# Altium schematic sheet TemperatureSense.SchDoc: fNIRS - Temperature Sense
size A4; CompanyName: UofT Capstone Team 2024991; DrawnBy: Tony Kim; Revision: 1; SheetNumber: 11; SheetTotal: 13
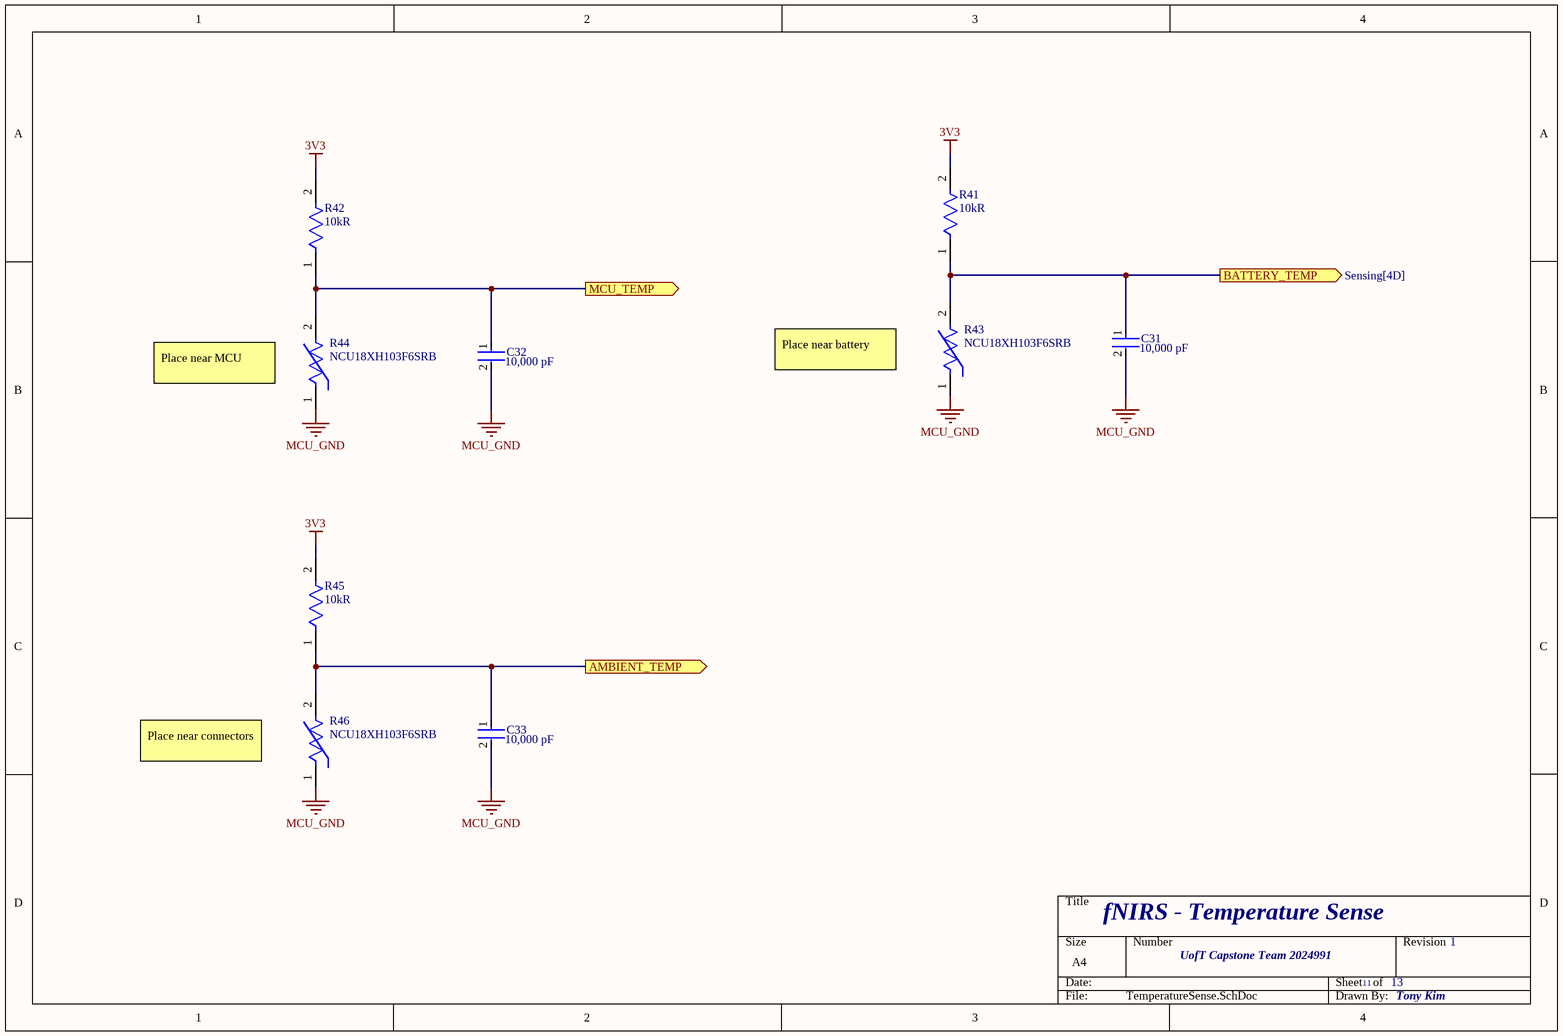
[diagram p0: TemperatureSense.SchDoc]

## Parts
C31  Capacitance: 10,000 pF  [FP-C0603C-CF-MFG]  (hidden comment: C0603C103K2RACTU)
C32  Capacitance: 10,000 pF  [FP-C0603C-CF-MFG]  (hidden comment: C0603C103K2RACTU)
C33  Capacitance: 10,000 pF  [FP-C0603C-CF-MFG]  (hidden comment: C0603C103K2RACTU)
R41  Resistance: 10kR  [FP-CRCW0603-e3-IPC_B]  (hidden comment: CRCW060310K0FKEB)
R42  Resistance: 10kR  [FP-CRCW0603-e3-IPC_B]  (hidden comment: CRCW060310K0FKEB)
R43  NCU18XH103F6SRB  [FP-NCU18-0_15-IPC_B]
R44  NCU18XH103F6SRB  [FP-NCU18-0_15-IPC_B]
R45  Resistance: 10kR  [FP-CRCW0603-e3-IPC_B]  (hidden comment: CRCW060310K0FKEB)
R46  NCU18XH103F6SRB  [FP-NCU18-0_15-IPC_B]

## Ports
AMBIENT_TEMP (out, see Sensing[4D]), BATTERY_TEMP (out, see Sensing[4D]), MCU_TEMP (out, see Sensing[4D])

## Nets
3V3: R41.2 R42.2 R45.2
MCU_GND: C31.2 C32.2 C33.2 R43.1 R44.1 R46.1
AMBIENT_TEMP: C33.1 R45.1 R46.2 ; port AMBIENT_TEMP
BATTERY_TEMP: C31.1 R41.1 R43.2 ; port BATTERY_TEMP
MCU_TEMP: C32.1 R42.1 R44.2 ; port MCU_TEMP

## Notes on the sheet
- (near R44) Place near MCU
- Place near battery
- Place near connectors

## Library data of the parts
C31-C33 = CMP-2006-03038-2: CAP CER 10000PF 200V X7R 0603; Manufacturer: KEMET; Material: Ceramic; Value: 10,000 pF; Temperature Coefficient: 30ppm/°C; Tolerance: 0.1; Automotive Grade: Grade 1; Voltage Rating: 200 V; Manufacturer Part Number: C0603C103K2RACTU; ComponentLink2Description: Datasheet; Package: C0603C-CF; Device Class L2: Capacitors; Mouser Description: Multilayer Ceramic Capacitors MLCC - SMD/SMT 200volts 10000pF X7R 10%; Device Class L3: Ceramic Capacitors; Temperature Range Low: -55°C; Category: Cap; Device Class L1: Passive Components; Lead Free: Yes; Octopart: https://octopart.com/c0603c103k2ractu-kemet-1061947; ComponentLink2URL: https://api.kemet.com/component-edge/download/datasheet/C0603C100J5GACAUTO.pdf; Temperature Characteristic: X7R; Temperature: -55°C to +125°C; Automotive: Yes; Temperature Range High: +125°C; Digikey Description: CAP CER 10000PF 200V X7R 0603; Height: 0.87mm; RoHS: TRUE
R41 R42 R45 = CMP-2000-03836-2: RES Thick Film, 10kΩ, 1%, 0.1W, 100ppm/°C, 0603; Voltage Rating: 75V; Max Power Dissipation: 100mW; Min Operating Temperature: -55°C; Packaging: Tape and Reel; Temperature Coefficient: 100ppm/°C; Case/Package: 0603; Max Operating Temperature: 155°C; Package Quantity: 10000; Voltage Rating (DC): 75V; Depth: 0.85mm; Case Code (Imperial): 0603; Power Rating: 100mW; Military Standard: Not; Height: 0.02inch; Weight: 7.1E-05oz; Number of Pins: 2; Width: 0.033inch; Number of Terminations: 2; Contact Plating: Tin; Length: 1.55mm; Features: Automotive AEC-Q200; Lead Free: Lead Free; Tolerance: 1%; Composition: Thick Film; Radiation Hardening: No; Case Code (Metric): 1608
R43 R44 R46 = CMP-06022-000547-2: THERMISTOR NTC; Min Operating Temperature: -40°C; Case Code (Metric): 1608; Max Operating Temperature: 150°C; RoHS Compliant: Yes; Case/Package: 0603; Case Code (Imperial): 0603; REACH SVHC: No SVHC